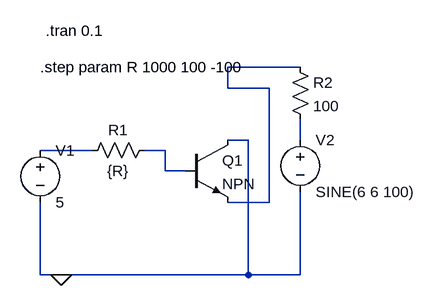
[diagram p0: schematic Draft18.asc]
Draft18.asc, the LTspice schematic file:
Version 4
SHEET 1 880 680
WIRE 608 192 496 192
WIRE 496 224 496 192
WIRE 560 224 496 224
WIRE 528 304 496 304
WIRE 608 304 608 272
WIRE 288 320 208 320
WIRE 400 320 368 320
WIRE 400 352 400 320
WIRE 432 352 400 352
WIRE 560 400 560 224
WIRE 560 400 496 400
WIRE 208 512 208 400
WIRE 240 512 208 512
WIRE 528 512 528 304
WIRE 528 512 240 512
WIRE 608 512 608 384
WIRE 608 512 528 512
FLAG 240 512 0
SYMBOL voltage 208 304 R0
SYMATTR InstName V1
SYMATTR Value 5
SYMBOL res 384 304 R90
WINDOW 0 0 56 VBottom 2
WINDOW 3 32 56 VTop 2
SYMATTR InstName R1
SYMATTR Value {R}
SYMBOL voltage 608 288 R0
SYMATTR InstName V2
SYMATTR Value SINE(6 6 100)
SYMBOL res 592 176 R0
SYMATTR InstName R2
SYMATTR Value 100
SYMBOL npn 432 304 R0
SYMATTR InstName Q1
TEXT 208 192 Left 2 !.step param R 1000 100 -100
TEXT 216 136 Left 2 !.tran 0.1

The netlist it stands for:
* Draft18.asc
V1 N003 0 5
R1 N004 N003 {R}
V2 N002 0 SINE(6 6 100)
R2 N001 N002 100
Q1 0 N004 N001 0 NPN
.model NPN NPN
.model PNP PNP
.lib standard.bjt
.step param R 1000 100 -100
.tran 0.1
.backanno
.end